# Altium schematic sheet Power_Supply_Regulation.SchDoc
size A4; DocumentNumber: 2; SheetNumber: 2; SheetTotal: 4
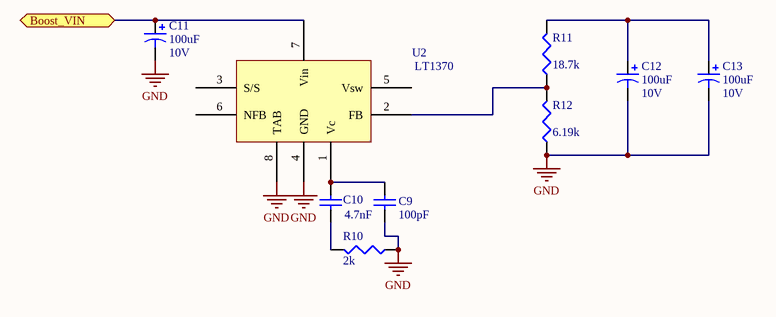
[diagram p0: Power_Supply_Regulation.SchDoc]

## Parts
C9  value 100pF  [1608[0603]]  (hidden comment: Cap Semi)
C10  value 4.7nF  [1608[0603]]  (hidden comment: Cap Semi)
C11  value 100uF  Voltage: 10V  [1812]  (hidden comment: Cap Pol3)
C12  value 100uF  Voltage: 10V  [1812]  (hidden comment: Cap Pol3)
C13  value 100uF  Voltage: 10V  [1812]  (hidden comment: Cap Pol3)
R10  value 2k  [J1-0603]  (hidden comment: Res3)
R11  value 18.7k  [J1-0603]  (hidden comment: Res3)
R12  value 6.19k  [J1-0603]  (hidden comment: Res3)
U2  LT1370  [TO127P1520-8L]

## Ports
Boost_VIN

## Nets
GND: C9.1 C11.2 C12.2 C13.2 R10.1 R12.1 U2.4(GND) U2.8(TAB)
Boost_VIN: C11.1 U2.7(Vin) ; port Boost_VIN
NetC9_2: C9.2 C10.2 U2.1(Vc)
NetC10_1: C10.1 R10.2
NetC12_1: C12.1 C13.1 R11.2
NetR11_1: R11.1 R12.2 U2.2(FB)

Not connected (* = marked no-connect by the designer): U2 3(S/S) 5(Vsw) 6(NFB)

## Library data of the parts
C9 C10 = Cap Semi: Capacitor (Semiconductor SIM Model); Published: 8-Jun-2000; LatestRevisionDate: 29-May-2009; LatestRevisionNote: IPC-7351 Footprint Added.; PackageReference: C1206; Publisher: Altium Limited; PackageDescription: Chip Capacitor
C11-C13 = Cap Pol3: Polarized Capacitor (Surface Mount); Part: AVX TPSD107M010R0100; Published: 8-Jun-2000; LatestRevisionDate: 29-May-2009; LatestRevisionNote: IPC-7351 Footprint Added.; PackageReference: C0805; Publisher: Altium Limited; PackageDescription: Chip Capacitor
R10-R12 = Res3: Resistor; Published: 8-Jun-2000; LatestRevisionDate: 29-May-2009; LatestRevisionNote: IPC-7351 Footprint Added.; PackageReference: J1-0603; Publisher: Altium Limited; PackageDescription: Chip Resistor
U2 = LT1370: 500kHz High Efficiency 6A Switching Regulator